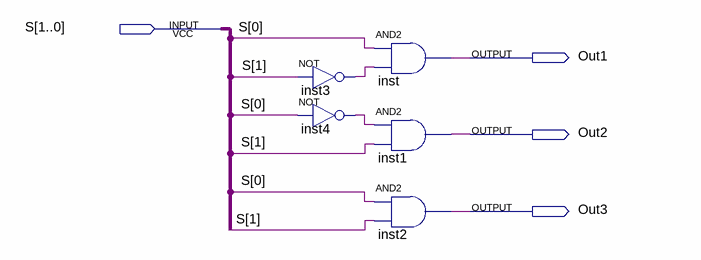
[diagram p0: schematic sheet]
// Quartus schematic LightDecoder.bdf as structural Verilog: 5 symbols, 4 pins
module LightDecoder (
  input  [1:0] S,
  output Out1,
  output Out2,
  output Out3
);

  wire inst3_out, inst4_out;

  not inst3 (inst3_out, S[1]);
  not inst4 (inst4_out, S[0]);
  and inst (Out1, S[0], inst3_out);
  and inst1 (Out2, inst4_out, S[1]);
  and inst2 (Out3, S[0], S[1]);
endmodule
